# Altium project PCB_STM32.PrjPcb
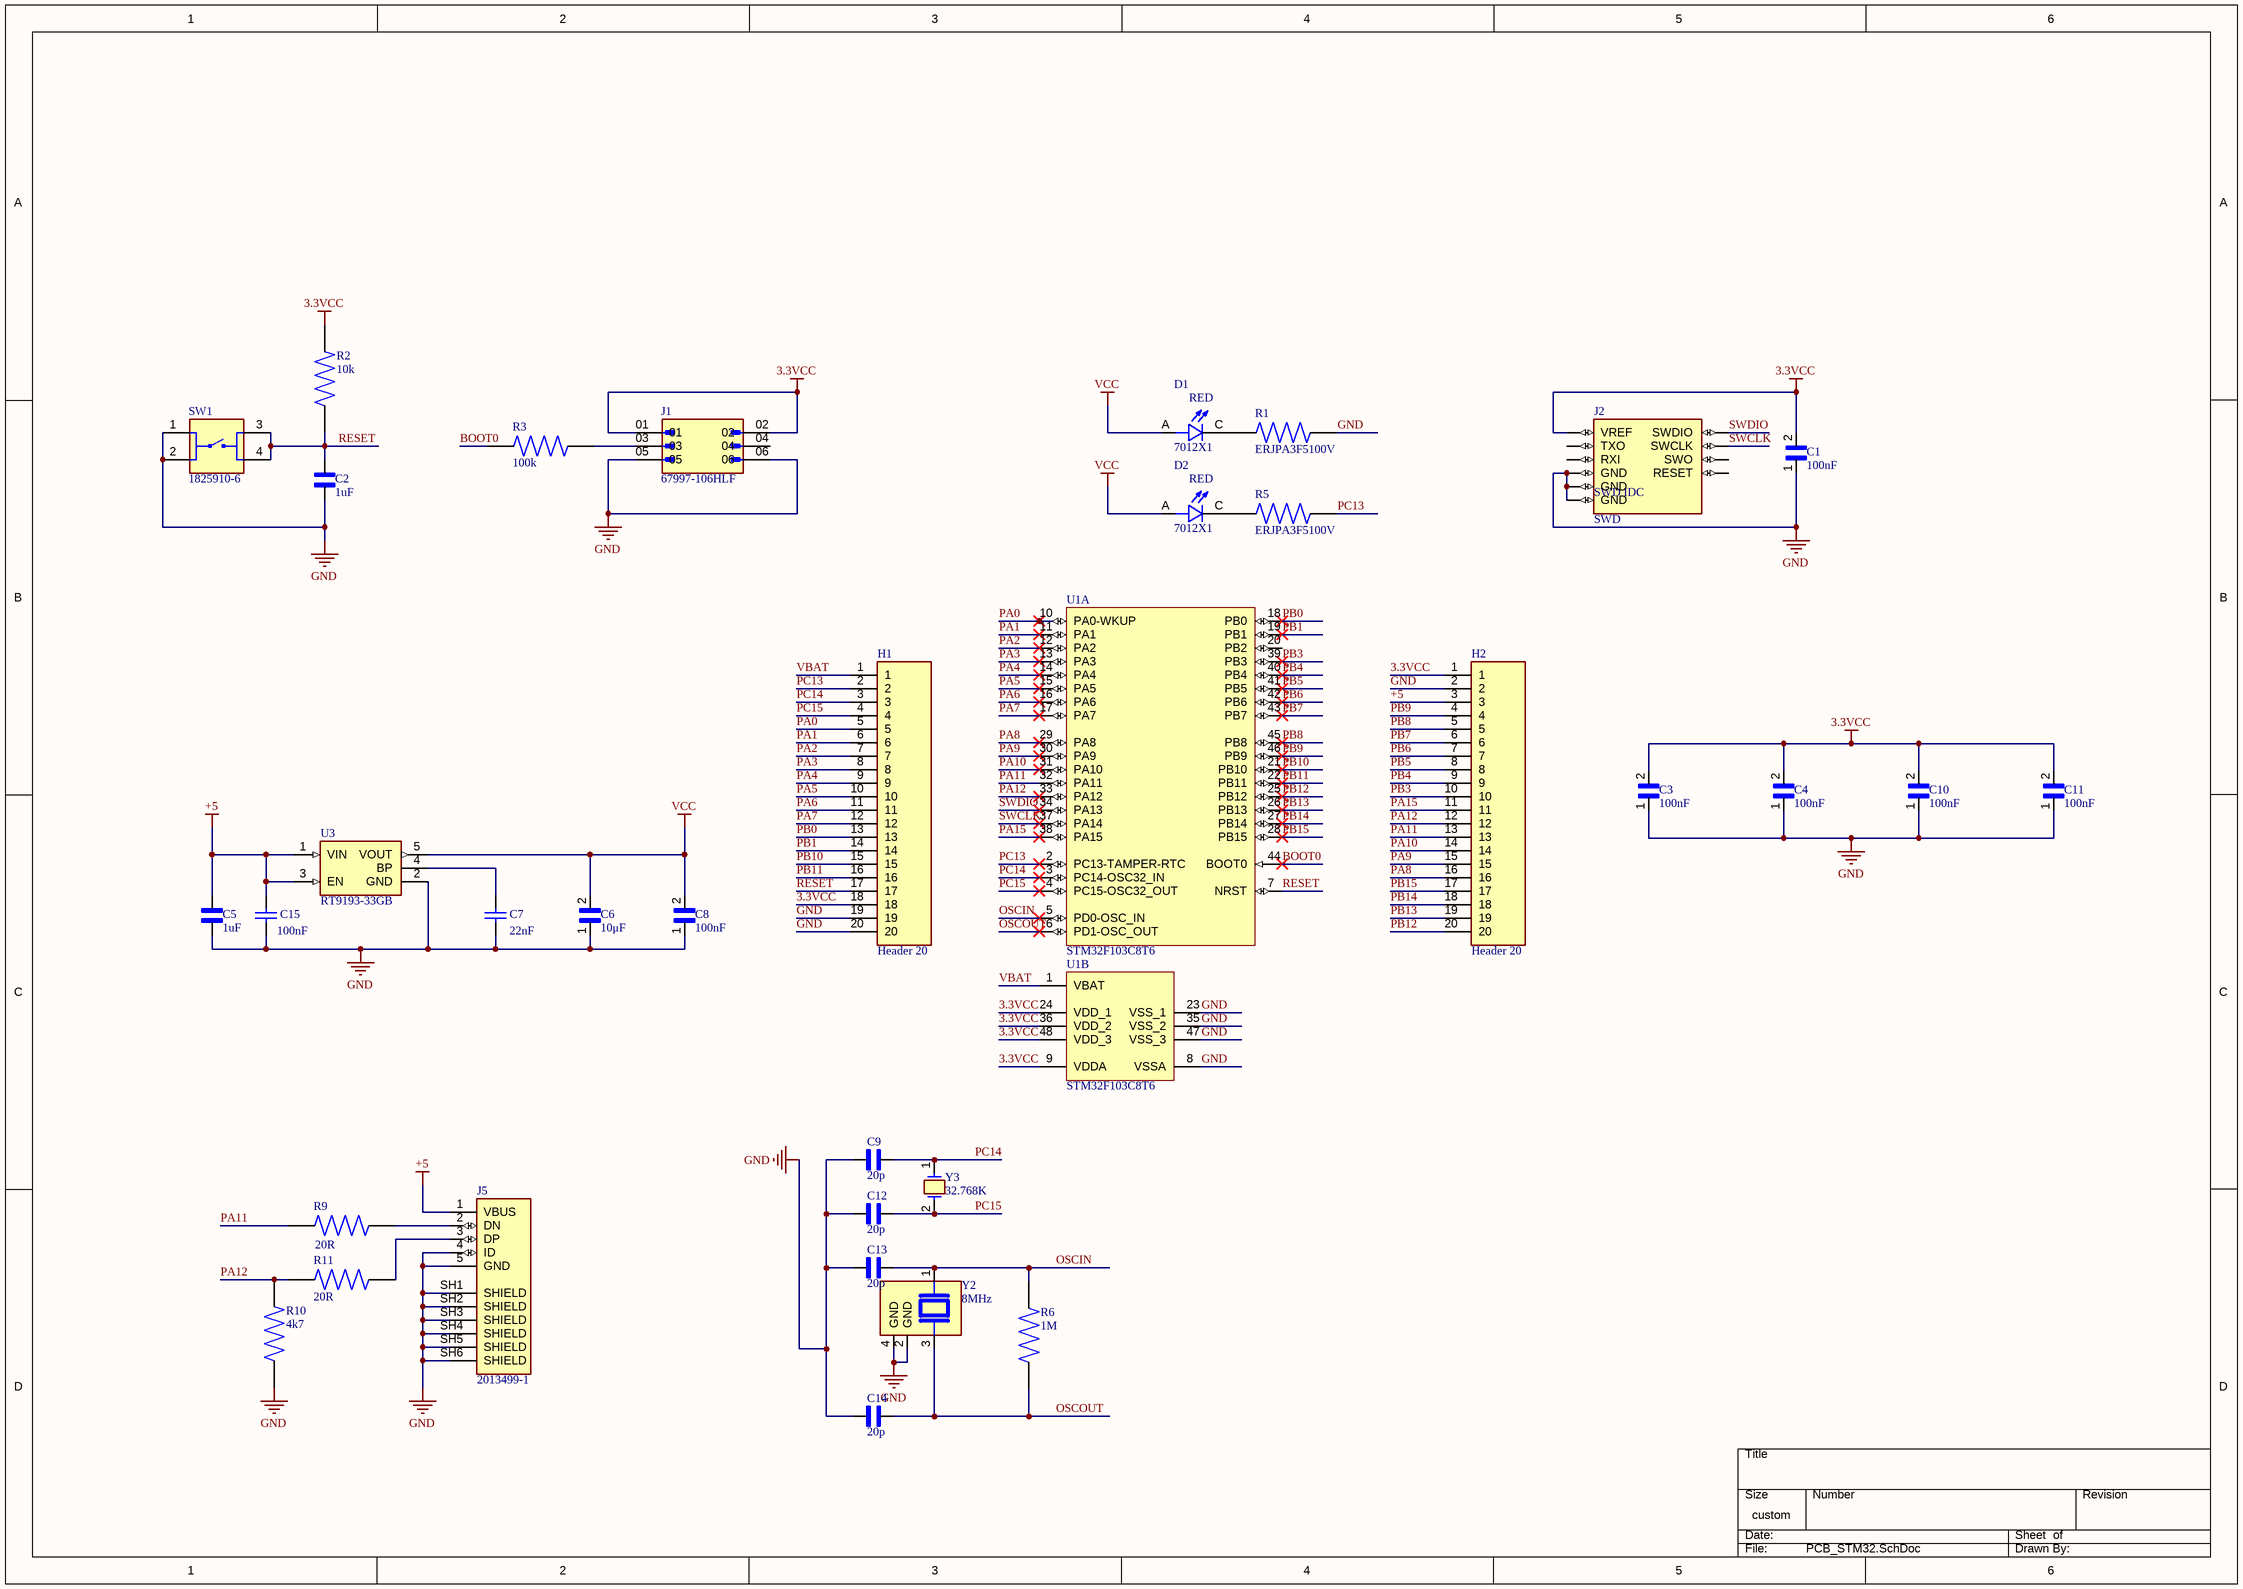
[diagram p0: PCB_STM32.SchDoc]
1 sheet, 35 parts. Net scope: global (net labels, ports and power ports of the same name join across sheets).
Board file: PCB_STM32.PcbDoc

## Sheet PCB_STM32.SchDoc
size 420 x 297 mm; SheetNumber: 1; SheetTotal: 1; SPICEModelCacheHHPPSWWV: <root> / <DocumentId>HHPPSWWV</DocumentId> / <CacheFrame Number="0"> / <Model Name="0201_885012104001_100nf" Kind="CKT"> / <Text>************************************************** / * Manufacturer:          WÃ¼rth Elektronik / * Kinds:                 MLCCs - Multilayer Ceramic Chip Capacitors / * Matchcode:             WCAP-CSGP_16V / * Library Type:          LTspice / * Version:               rev24a / * Created/modified by:   Ella / * Date and Time:         7/11/2024 / * Team:                  eiSos EDA Service / * Contact:               libraries@we-online.com / ************************************************** / * Copyright(C) 2024 WÃ¼rth Elektronik eiSos GmbH &amp; Co. KG / * All Rights Reserved. / ************************************************** / * Disclaimer: While WÃ¼rth Elektronik eiSos has made every reasonable effort to ensure the accuracy / * of the simulation models provided, WÃ¼rth Elektronik eiSos does not guarantee the exemption of error on / * the simulation models, nor does WÃ¼rth Elektronik eiSos guarantee that the simulation model is current. / * WÃ¼rth Elektronik eiSos reserves the right to make any adjustments at any time without notice. / * WÃ¼rth Elektronik eiSos expressly disclaims all implied warranties regarding this simulation model. / ************************************************** / .subckt 0201_885012104001_100nF 1 2 / Rser 1 3 0.038 / Lser 2 4 0.0000000008 / C1 3 4 0.0000001 / Rpar 3 4 1000000000 / .ends 0201_885012104001_100nF</Text> / </Model> / <Model Name="1206_885012008009_22nf" Kind="CKT"> / <Text>******* / .subckt 1206_885012008009_22nF 1 2 / Rser 1 3 0.011442234975 / Lser 2 4 8.6240711E-10 / C1 3 4 0.000000022 / Rpar 3 4 10000000000 / .ends 1206_885012008009_22nF</Text> / </Model> / </CacheFrame> / </root>

### Parts
C1  100nF  [WCAP-CSGP_0201_L0.6W0.3H0.3]
C2  1uF  [CAPC1608X55N]
C3  100nF  [WCAP-CSGP_0201_L0.6W0.3H0.3]
C4  100nF  [WCAP-CSGP_0201_L0.6W0.3H0.3]
C5  1uF  [CAPC1608X55N]
C6  10μF  [WCAP-CSGP_0402_L1W0.5H0.5]
C7  22nF  [WCAP-CSGP_1206_L3.2W1.6H1.6]
C8  100nF  [WCAP-CSGP_0201_L0.6W0.3H0.3]
C9  20p  [CAPC0603X33N]
C10  100nF  [WCAP-CSGP_0201_L0.6W0.3H0.3]
C11  100nF  [WCAP-CSGP_0201_L0.6W0.3H0.3]
C12  20p  [CAPC0603X33N]
C13  20p  [CAPC0603X33N]
C14  20p  [CAPC0603X33N]
C15  100nF  [WCAP-CSGP_0201_L0.6W0.3H0.3]
D1  7012X1  [LED_7012X1]
D2  7012X1  [LED_7012X1]
H1  Header 20  [TE_2-640456-0]
H2  Header 20  [TE_2-640456-0]
J1  67997-106HLF  [AMPHENOL_67997-106HLF]
J2  SWD  [ARM-JTAG-10-SWD-IDC]
J5  2013499-1  [TE_2013499-1]
R1  ERJPA3F5100V  [RES_ERJPA3F5100V]
R2  10k  [RESC2012X60N]
R3  100k  [RESC2012X60N]
R5  ERJPA3F5100V  [RES_ERJPA3F5100V]
R6  1M  [RESC2012X60N]
R9  20R  [RESC5025X120N]
R10  4k7  [RESC1608X55N]
R11  20R  [RESC5025X120N]
SW1  1825910-6  [SW_1825910-6-4]
U1  STM32F103C8T6  [STM-LQFP48_L]  (parts A,B of 2)
U3  RT9193-33GB  [SOT94P279X129-5N]
Y2  8MHz  [XTAL_ABM3B-8.000MHZ-10-1-U-T]
Y3  32.768K  [XTAL_NX3215SA-32.768K-STD-MUA-14]

### Nets
3.3VCC: C1.2 C3.2 C4.2 C10.2 C11.2 H1.18 H2.1 J1.01 J1.02 J2.VREF R2.1 U1.9(VDDA) U1.24(VDD_1) U1.36(VDD_2) U1.48(VDD_3)
+5: C5.1 C15.2 H2.3 J5.1(VBUS) U3.1(VIN) U3.3(EN)
GND: C1.1 C2.2 C3.1 C4.1 C5.2 C6.1 C7.1 C8.1 C9.1 C10.1 C11.1 C12.1 C13.1 C14.1 C15.1 H1.19 H1.20 H2.2 J1.05 J1.06 J2.GND@1(GND) J2.GND@2(GND) J2.GND@3(GND) J5.4(ID) J5.5(GND) J5.SH1(SHIELD) J5.SH2(SHIELD) J5.SH3(SHIELD) J5.SH4(SHIELD) J5.SH5(SHIELD) J5.SH6(SHIELD) R1.2 R10.1 SW1.1 SW1.2 U1.8(VSSA) U1.23(VSS_1) U1.35(VSS_2) U1.47(VSS_3) U3.2(GND) Y2.2(GND) Y2.4(GND)
VCC: C6.2 C8.2 D1.A D2.A U3.5(VOUT)
BOOT0: R3.1 U1.44(BOOT0)
OSCIN: C13.2 R6.2 U1.5(PD0-OSC_IN) Y2.1
OSCOUT: C14.2 R6.1 U1.6(PD1-OSC_OUT) Y2.3
PA0: H1.5 U1.10(PA0-WKUP)
PA1: H1.6 U1.11(PA1)
PA2: H1.7 U1.12(PA2)
PA3: H1.8 U1.13(PA3)
PA4: H1.9 U1.14(PA4)
PA5: H1.10 U1.15(PA5)
PA6: H1.11 U1.16(PA6)
PA7: H1.12 U1.17(PA7)
PA8: H2.16 U1.29(PA8)
PA9: H2.15 U1.30(PA9)
PA10: H2.14 U1.31(PA10)
PA11: H2.13 R9.1 U1.32(PA11)
PA12: H2.12 R10.2 R11.1 U1.33(PA12)
PA15: H2.11 U1.38(PA15)
PB0: H1.13 U1.18(PB0)
PB1: H1.14 U1.19(PB1)
PB3: H2.10 U1.39(PB3)
PB4: H2.9 U1.40(PB4)
PB5: H2.8 U1.41(PB5)
PB6: H2.7 U1.42(PB6)
PB7: H2.6 U1.43(PB7)
PB8: H2.5 U1.45(PB8)
PB9: H2.4 U1.46(PB9)
PB10: H1.15 U1.21(PB10)
PB11: H1.16 U1.22(PB11)
PB12: H2.20 U1.25(PB12)
PB13: H2.19 U1.26(PB13)
PB14: H2.18 U1.27(PB14)
PB15: H2.17 U1.28(PB15)
PC13: H1.2 R5.2 U1.2(PC13-TAMPER-RTC)
PC14: C9.2 H1.3 U1.3(PC14-OSC32_IN) Y3.1
PC15: C12.2 H1.4 U1.4(PC15-OSC32_OUT) Y3.2
RESET: C2.1 H1.17 R2.2 SW1.3 SW1.4 U1.7(NRST)
SWCLK: J2.SWCLK U1.37(PA14)
SWDIO: J2.SWDIO U1.34(PA13)
VBAT: H1.1 U1.1(VBAT)
NetC7_2: C7.2 U3.4(BP)
NetD1_C: D1.C R1.1
NetD2_C: D2.C R5.1
NetJ1_03: J1.03 R3.2
NetJ5_2: J5.2(DN) R9.2
NetJ5_3: J5.3(DP) R11.2

Not connected (* = marked no-connect by the designer): J1 04; J2 RESET RXI SWO TXO; U1 20(PB2)

### Notes on the sheet
- THIS DOCUMENT AND THE DATA DISCLOSED HEREIN OR
- HEREWITH IS THE PROPERTY OF ALTIUM LIMITED AND MAY
- DWG NO:
- REVISION
- REV:
- DESCRIPTION
- DATE
- APPROVED
- BE FREELY DISTRIBUTED IN WHOLE. NO RIGHTS ARE
- RESERVED OR EXPRESS OR IMPLIED WARANTEE GIVEN.
- ENG:
- APPROVALS
- PROJECT
- DSN:
- CHK:
- REFERENCE DOCUMENTS
- PROJECT REVISION:
- TITLE
- DOCUMENT REVISION:
- DESIGN ITEM:
- BOM:
- FAB DWG:
- PCB DWG:
- ASSY DWG:
- SCALE:
- A3
- SIZE
- CAGE CODE
- FILE NAME
- DWG NO.
- SHEET
- OF
- REV
- (in symbol 7012X1) RED
- (in symbol ARM-JTAG-SWD) SWD IDC

### Library data of the parts
C1 C3 C4 C8 C10 C11 = C2012X7R1H104K085AA: 0.1 ÂµF Â±10% 50V Ceramic Capacitor X7R 0805 (2012 Metric); MF: TDK; Purchase-URL: https://pricing.snapeda.com/search/part/C2012X7R1H104K085AA/?ref=eda; Package: 2012 TDK; MP: C2012X7R1H104K085AA; Value: *; SnapEDA_Link: https://www.snapeda.com/parts/C2012X7R1H104K085AA/TDK/view-part/?ref=snap; Digi-Key_Part_Number: 445-7534-1-ND; Check_prices: https://www.snapeda.com/parts/C2012X7R1H104K085AA/TDK/view-part/?ref=eda
C2 C5 = CGB3B3X6S1A105K055AB: Cap Ceramic 1uF 10V X6S 10% SMD 0603 105Â°C Punched Paper T/R; MF: TDK; SnapEDA_Link: https://www.snapeda.com/parts/CGB3B3X6S1A105K055AB/TDK/view-part/?ref=snap; Package: 1608 TDK; Value: *; MP: CGB3B3X6S1A105K055AB; Check_prices: https://www.snapeda.com/parts/CGB3B3X6S1A105K055AB/TDK/view-part/?ref=eda
C6 = C2012X5R1C106M085AC: 10ÂµF Â±20% 16V Ceramic Capacitor X5R 0805 (2012 Metric); MF: TDK; Value: *; SnapEDA_Link: https://www.snapeda.com/parts/C2012X5R1C106M085AC/TDK/view-part/?ref=snap; Purchase-URL: https://pricing.snapeda.com/search/part/C2012X5R1C106M085AC/?ref=eda; Price: None; Availability: In Stock; Package: 2012 TDK; MP: C2012X5R1C106M085AC; Check_prices: https://www.snapeda.com/parts/C2012X5R1C106M085AC/TDK/view-part/?ref=eda
C7 = 885012008009: WCAP-CSGP Multilayer Ceramic Chip Capacitor, General Purpose, size 1206, NP0, 22nF, 10V; Manufacturer: Wurth Elektronik; Case/Size Code: 1206; Capacitance Tolerance: +/-5%; Insulation Resistance: 10GΩ; Q Factor: 1000; Technical Reference: NP01206223J010DFCT10000; Manufacturer Part Number: 885012008009; Category: Multilayer Ceramic Chip Capacitors; Match Code: WCAP-CSGP; ComponentLink1Description: Website Link; ComponentLink1URL: https://www.we-online.com/redexpert/article/885012008009?ad; ComponentLink2Description: Datasheet Link; ComponentLink2URL: https://www.we-online.com/redexpert/spec/885012008009?ad; Mount: Surface Mount; Min Operating Temperature: -55°C; Max Operating Temperature: 125°C; Packaging: Tape and Reel; Length: 3.2mm; Width: 1.6mm; Height: 1.6mm; Capacitance: 22nF; Ceramic Type: NP0; Rated Voltage (DC): 10V
C9 C12-C14 = GRM0335C1H200JA01D: SMD capacitor C0G(EIA) with capacitance 20pF Tol.5%. Rated voltage 50Vdc 125C; MF: Murata Electronics; SnapEDA_Link: https://www.snapeda.com/parts/GRM0335C1H200JA01D/Murata+Electronics+North+America/view-part/?ref=snap; Package: 0603 Murata; Value: *; MP: GRM0335C1H200JA01D; Check_prices: https://www.snapeda.com/parts/GRM0335C1H200JA01D/Murata+Electronics+North+America/view-part/?ref=eda
C15 = 885012104001: WCAP-CSGP Multilayer Ceramic Chip Capacitor, General Purpose, size 0201, X5R Class II, 100nF, 16V; Manufacturer: Wurth Elektronik; Case/Size Code: 0201; Capacitance Tolerance: +/-10%; Dissipation Factor: 10%; Insulation Resistance: 1GΩ; Technical Reference: X5R0201104K016DFCT10000; Manufacturer Part Number: 885012104001; Category: Multilayer Ceramic Chip Capacitors; Match Code: WCAP-CSGP; ComponentLink1Description: Website Link; ComponentLink1URL: https://www.we-online.com/redexpert/article/885012104001?ad; ComponentLink2Description: Datasheet Link; ComponentLink2URL: https://www.we-online.com/redexpert/spec/885012104001?ad; Mount: Surface Mount; Min Operating Temperature: -55°C; Max Operating Temperature: 85°C; Packaging: Tape and Reel; Length: 0.6mm; Width: 0.3mm; Height: 0.3mm; Capacitance: 100nF; Ceramic Type: X5R Class II; Rated Voltage (DC): 16V
D1 D2 = 7012X1: Red - LED Indication - Discrete 1.7V 0805 (2012 Metric); MF: VCC; Package: 0805 Visual Communications; Purchase-URL: https://pricing.snapeda.com/search/part/7012X1/?ref=eda; MP: 7012X1; Value: *; Availability: In Stock; SnapEDA_Link: https://www.snapeda.com/parts/7012X1/Visual+Communications/view-part/?ref=snap; Price: None; Check_prices: https://www.snapeda.com/parts/7012X1/Visual+Communications/view-part/?ref=eda
H1 H2 = 2-640456-0: Header Friction Lock MTA-100 20 250VAC Polyester Tin Copper Alloy Tin | TE Connectivity 2-640456-0; Product_Type: Connector; Number_of_Positions: 20; Centerline_Pitch: 2.54 mm[.1 in]; SnapEDA_Link: https://www.snapeda.com/parts/2-640456-0/TE+Connectivity+AMP+Connectors/view-part/?ref=snap; Package: None; Value: *; MF: TE Connectivity; MP: 2-640456-0; EU_RoHS_Compliance: Compliant; Check_prices: https://www.snapeda.com/parts/2-640456-0/TE+Connectivity+AMP+Connectors/view-part/?ref=eda
J1 = 67997-106HLF: BergStikÂ®, Board to Board connector, Unshrouded vertical header, Through Hole, Double Row, 6 Positions, 2.54 mm (0.100in) Pitch; MF: Amphenol ICC; Availability: In Stock; Purchase-URL: https://pricing.snapeda.com/search/part/67997-106HLF/?ref=eda; Package: None; SnapEDA_Link: https://www.snapeda.com/parts/67997-106HLF/Amphenol+FCI/view-part/?ref=snap; MP: 67997-106HLF; Check_prices: https://www.snapeda.com/parts/67997-106HLF/Amphenol+FCI/view-part/?ref=eda; Price: None; Value: *
J2 = ARM-JTAG-SWD: DEBUG ADAPTER FOR ARM-USB-TINY-H; MF: Olimex LTD; Check_prices: https://www.snapeda.com/parts/ARM-JTAG-SWD/Olimex+LTD/view-part/?ref=eda; Value: *; Purchase-URL: https://pricing.snapeda.com/search/part/ARM-JTAG-SWD/?ref=eda; Price: None; MP: ARM-JTAG-SWD; SnapEDA_Link: https://www.snapeda.com/parts/ARM-JTAG-SWD/Olimex+LTD/view-part/?ref=snap; Availability: In Stock; Package: None
R1 R5 = ERJPA3F5100V: RES, THICK FILM, 510R, 1%, 0.25W, 0603; MF: Panasonic; MP: ERJ-PA3F5100V; SnapEDA_Link: https://www.snapeda.com/parts/ERJ-PA3F5100V/Panasonic/view-part/?ref=snap; Package: 1608-2 Panasonic; Value: *; Check_prices: https://www.snapeda.com/parts/ERJ-PA3F5100V/Panasonic/view-part/?ref=eda
R2 = RC0805FR-0710KL: 10 kOhms Â±1% 0.125W, 1/8W Chip Resistor 0805 (2012 Metric) Moisture Resistant Thick Film; MF: Yageo; Value: *; SnapEDA_Link: https://www.snapeda.com/parts/RC0805FR-0710KL/Yageo/view-part/?ref=snap; Purchase-URL: https://pricing.snapeda.com/search/part/RC0805FR-0710KL/?ref=eda; Availability: In Stock; Price: None; Package: 2012 Rohm Semiconductor; Check_prices: https://www.snapeda.com/parts/RC0805FR-0710KL/Yageo/view-part/?ref=eda; MP: RC0805FR-0710KL
R3 = RC0805FR-07100KL: 100 kOhms Â±1% 0.125W, 1/8W Chip Resistor 0805 (2012 Metric) Moisture Resistant Thick Film; MF: Yageo; SnapEDA_Link: https://www.snapeda.com/parts/RC0805FR-07100KL/Yageo/view-part/?ref=snap; Package: 2012 Yageo; Value: *; MP: RC0805FR-07100KL; Check_prices: https://www.snapeda.com/parts/RC0805FR-07100KL/Yageo/view-part/?ref=eda
R6 = RC0805FR-071ML: 1 MOhms Â±1% 0.125W, 1/8W Chip Resistor 0805 (2012 Metric) Moisture Resistant Thick Film; MF: Yageo; SnapEDA_Link: https://www.snapeda.com/parts/RC0805FR-071ML/Yageo/view-part/?ref=snap; Package: 2012 Yageo; Value: *; MP: RC0805FR-071ML; Check_prices: https://www.snapeda.com/parts/RC0805FR-071ML/Yageo/view-part/?ref=eda
R9 R11 = 3-2176397-2: Package: None; Price: None; Value: *; MP: 3-2176397-2; Availability: Unavailable
R10 = CRG0603F4K7: Resistor, Thick Film, Res 4.7 Kilohms, Pwr-Rtg 0.1 W, Tol 1%, SMT, 0603 | TE Connectivity CRG0603F4K7; Power_Rating: .1 W; Resistance: 4.7K; Voltage_Rating: 50 V; SnapEDA_Link: https://www.snapeda.com/parts/CRG0603F4K7/TE+Connectivity+Passive+Product/view-part/?ref=snap; Package: 0603; Value: *; MF: TE Connectivity; MP: CRG0603F4K7; EU_RoHS_Compliance: Compliant with Exemptions; Tolerance: 1%; Check_prices: https://www.snapeda.com/parts/CRG0603F4K7/TE+Connectivity+Passive+Product/view-part/?ref=eda
SW1 = 1825910-6: Switch Push Button OFF (ON) SPST Round Button 0.05A 24VDC Momentary Contact PC Pins Thru-Hole; MF: TE Connectivity; Value: *; MP: 1825910-6; Package: None; Check_prices: https://www.snapeda.com/parts/1825910-6/TE+Connectivity+ALCOSWITCH+Switches/view-part/?ref=eda; SnapEDA_Link: https://www.snapeda.com/parts/1825910-6/TE+Connectivity+ALCOSWITCH+Switches/view-part/?ref=snap; Digi-Key_Part_Number: 450-1650-ND; Purchase-URL: https://pricing.snapeda.com/search/part/1825910-6/?ref=eda
U1 = CMP-0237-00215-3: ARM Cortex-M3 32-bit MCU, 64 KB Flash, 20 KB Internal RAM, 37 I/Os, 48-pin LQFP, -40 to 85 degC, Tray; Supply Voltage(Vcc) min (V): 2; Internal RAM Size (kB): 20; FLASH Size (Prog) (kB): 64; A/D Converter: 2x12-bit (10 Channel); I/Os (High Current): 37; Operating Frequency(F) (Processor speed) (MHz): 72; Core: ARM Cortex-M3; ComponentLink3Description: Package Specification; Mounting Technology: Surface Mount; PartNumber: STM32F103C8T6; PackageReference: LQFP48; Packing: Tray; ComponentLink3URL: http://www.st.com/st-web-ui/static/active/en/resource/technical/document/datasheet/DM00058181.pdf; DatasheetVersion: Rev. 16; ComponentLink1URL: http://www.st.com/web/en/home.html; PackageVersion: Rev. 6, 06/2013; ComponentLink2URL: http://www.st.com/st-web-ui/static/active/en/resource/technical/document/datasheet/CD00161566.pdf; ComponentLink1Description: Manufacturer URL; ComponentLink2Description: Datasheet; PackageDescription: 48-Pin Low Profile Quad Flat Package, 7 x 7 mm Body, 0.5 mm Pitch
U3 = RT9193-33GB: Linear Voltage Regulator IC Positive Fixed 1 Output 300mA TSOT-23-5; MF: Richtek USA; SnapEDA_Link: https://www.snapeda.com/parts/RT9193-33GB/Richtek+USA+Inc./view-part/?ref=snap; Package: SOT-23-5 Richtek; MP: RT9193-33GB; Check_prices: https://www.snapeda.com/parts/RT9193-33GB/Richtek+USA+Inc./view-part/?ref=eda; Purchase-URL: https://pricing.snapeda.com/search/part/RT9193-33GB/?ref=eda; Digi-Key_Part_Number: 1028-1014-2-ND; Value: *
Y2 = ABM3B-8.000MHZ-10-1-U-T: 8 MHz Â±10ppm Crystal 10pF 200 Ohms 4-SMD, No Lead; MF: Abracon; SnapEDA_Link: https://www.snapeda.com/parts/ABM3B-8.000MHZ-10-1-U-T/Abracon/view-part/?ref=snap; Package: SMD-4 Abracon LLC; Value: *; MP: ABM3B-8.000MHZ-10-1-U-T; Check_prices: https://www.snapeda.com/parts/ABM3B-8.000MHZ-10-1-U-T/Abracon/view-part/?ref=eda
Y3 = NX3215SA-32.768K-STD-MUA-14: 32.768kHz Â±20ppm Crystal 6pF 70 kOhms 2-SMD, No Lead  MANUFACTURER: NIHON DEMPA KOGYO; Availability: Unavailable; Package: None; MP: NX3215SA-32.768K-STD-MUA-14; Value: *; Price: None
J5 = 2013499-1: Package: None; Price: None; Value: *; MP: 2013499-1; Availability: Unavailable